# Altium schematic sheet I2C_buttons.SchDoc
size A4; SheetNumber: 6; SheetTotal: 6
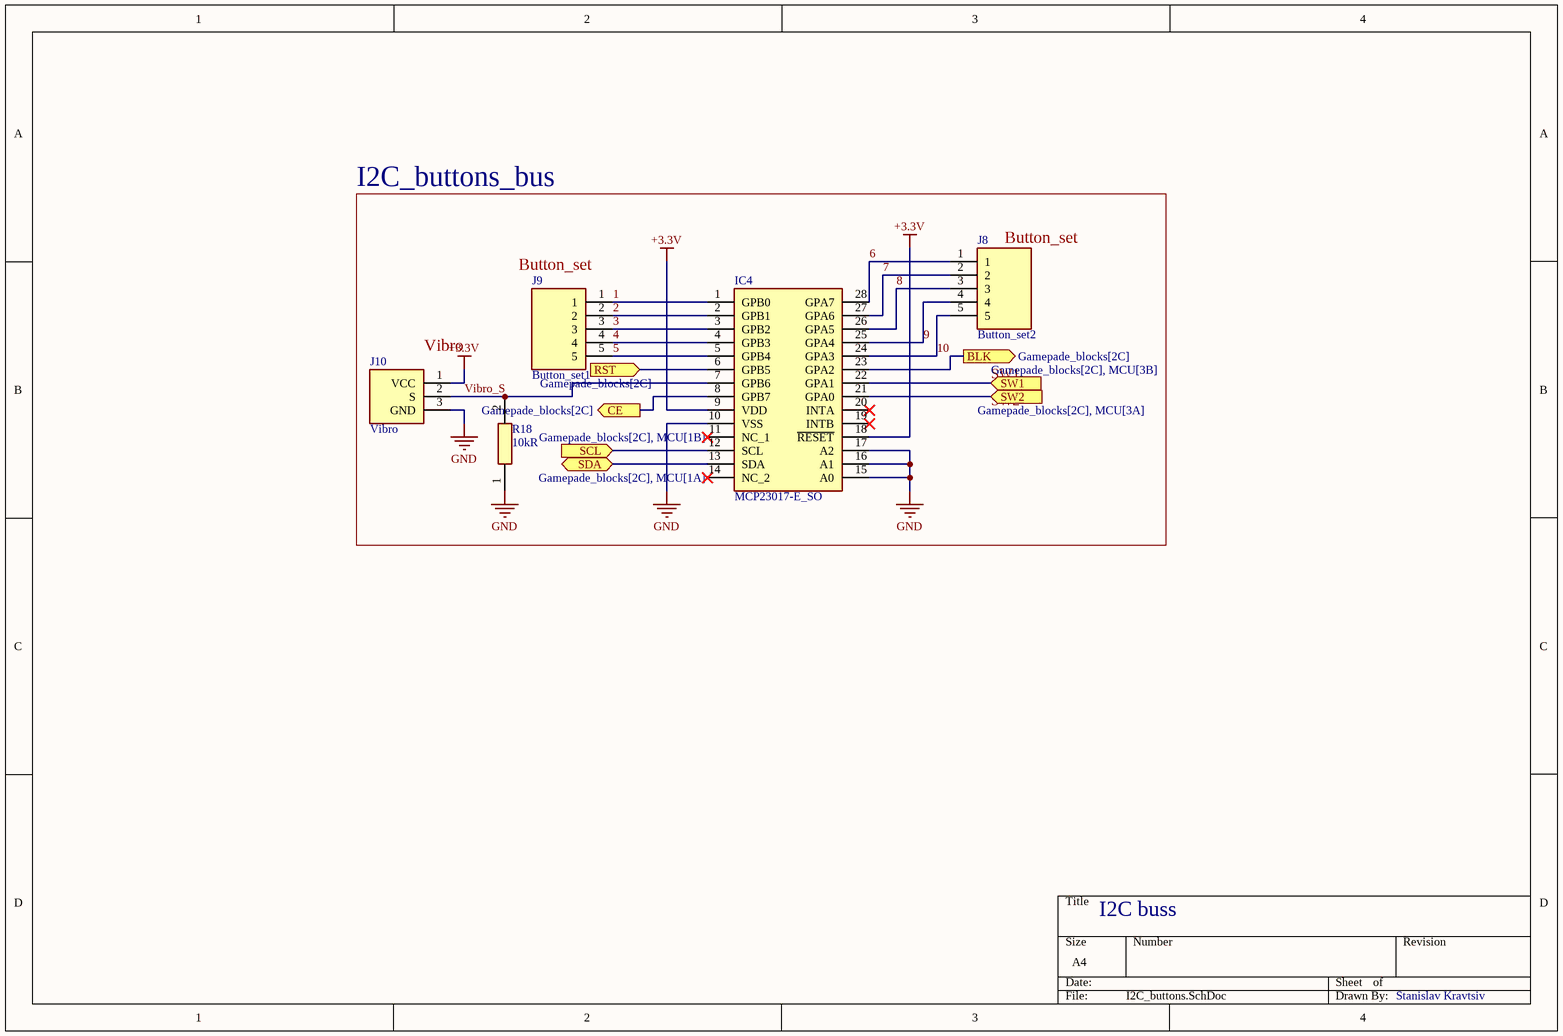
[diagram p0: I2C_buttons.SchDoc]

## Parts
IC4  MCP23017-E_SO  [SOIC127P1030X265-28N]
J8  Button_set2  [1.25_JSH-GH_5]
J9  Button_set1  [1.25_JSH-GH_5]
J10  Vibro  [B3BXHALFSN]
R18  10kR  [RESC1608X55N]

## Ports
BLK (out, see Gamepade_blocks[2C]), CE (out, see Gamepade_blocks[2C]), RST (in, see Gamepade_blocks[2C]), SCL (in, see Gamepade_blocks[2C], MCU[1B]), SDA (bidir, see Gamepade_blocks[2C], MCU[1A]), SW1 (in, see Gamepade_blocks[2C], MCU[3B]), SW2 (in, see Gamepade_blocks[2C], MCU[3A])

## Nets
+3.3V: IC4.9(VDD) IC4.18(~{RESET}) J10.1(VCC)
GND: IC4.10(VSS) IC4.15(A0) IC4.16(A1) IC4.17(A2) J10.3(GND) R18.1
1: IC4.1(GPB0) J9.1
2: IC4.2(GPB1) J9.2
3: IC4.3(GPB2) J9.3
4: IC4.4(GPB3) J9.4
5: IC4.5(GPB4) J9.5
6: IC4.28(GPA7) J8.1
7: IC4.27(GPA6) J8.2
8: IC4.26(GPA5) J8.3
9: IC4.25(GPA4) J8.4
10: IC4.24(GPA3) J8.5
BLK: IC4.23(GPA2) ; port BLK
CE: IC4.8(GPB7) ; port CE
RST: IC4.6(GPB5) ; port RST
SCL: IC4.12(SCL) ; port SCL
SDA: IC4.13(SDA) ; port SDA
SW1: IC4.22(GPA1) ; port SW1
SW2: IC4.21(GPA0) ; port SW2
Vibro_S: IC4.7(GPB6) J10.2(S) R18.2

Not connected (* = marked no-connect by the designer): IC4 11(NC_1)* 14(NC_2)* 19(INTB)* 20(INTA)*

## Notes on the sheet
- I2C_buttons_bus
- (near J8) Button_set
- (near J9) Button_set
- (near J10) Vibro
- (near J8) SW1
- SW2
- I2C buss
- Stanislav Kravtsiv

## Library data of the parts
IC4 = MCP23017-E_SO: Integrated Circuit; Manufacturer_Name: Microchip; Manufacturer_Part_Number: MCP23017-E/SO; Datasheet Link: https://datasheet.datasheetarchive.com/originals/distributors/SFDatasheet-4/sf-00090057.pdf; Height: 2.65mm; Mouser Part Number: 579-MCP23017-E/SO; Mouser Price/Stock: https://www.mouser.co.uk/ProductDetail/Microchip-Technology/MCP23017-E-SO?qs=usxtMOJb1Rz8hft7vV7YMQ%3D%3D; Arrow Part Number: MCP23017-E/SO; Arrow Price/Stock: https://www.arrow.com/en/products/mcp23017-eso/microchip-technology.html?utm_currency=USD&region=europe
J8 J9 = B5B-XH-AM__LF__SN_: Connector; Manufacturer_Name: JST (JAPAN SOLDERLESS TERMINALS); Manufacturer_Part_Number: B5B-XH-AM (LF)(SN); Datasheet Link: http://uk.rs-online.com/web/p/products/1755317; Height: 7mm; Arrow Part Number: B5B-XH-AM (LF)(SN); Arrow Price/Stock: https://www.arrow.com/en/products/b5b-xh-am-lf-sn/jst-manufacturing
J10 = B3B-XH-A_LF__SN_: Connector; Manufacturer_Name: JST (JAPAN SOLDERLESS TERMINALS); Manufacturer_Part_Number: B3B-XH-A(LF)(SN); Datasheet Link: https://datasheet.lcsc.com/szlcsc/1812131720_JST-Sales-America-B3B-XH-A-LF-SN_C144394.pdf; Height: 7mm; Mouser Part Number: 306-B3BXHALFSNP; Mouser Price/Stock: https://www.mouser.co.uk/ProductDetail/JST-Commercial/B3B-XH-ALFSN?qs=cdbOS8ANM9BVkoboCCIEMQ%3D%3D; Arrow Part Number: B3B-XH-A(LF)(SN); Arrow Price/Stock: https://www.arrow.com/en/products/b3b-xh-a-lf-sn/jst-manufacturing.html?utm_currency=USD&region=europe
R18 = RC0603FR0710KL: Resistor; Manufacturer_Name: Yageo Group; Value: 10kOhm; Datasheet Link: http://www.yageo.com/documents/recent/PYu-RC0603_51_RoHS_L_v5.pdf; Height: 0.55mm; Manufacturer_Part_Number: RC0603FR0710KL; Arrow Part Number: RC0603FR0710KL; Arrow Price/Stock: https://www.arrow.com/en/products/rc0603fr-0710kl/yageo